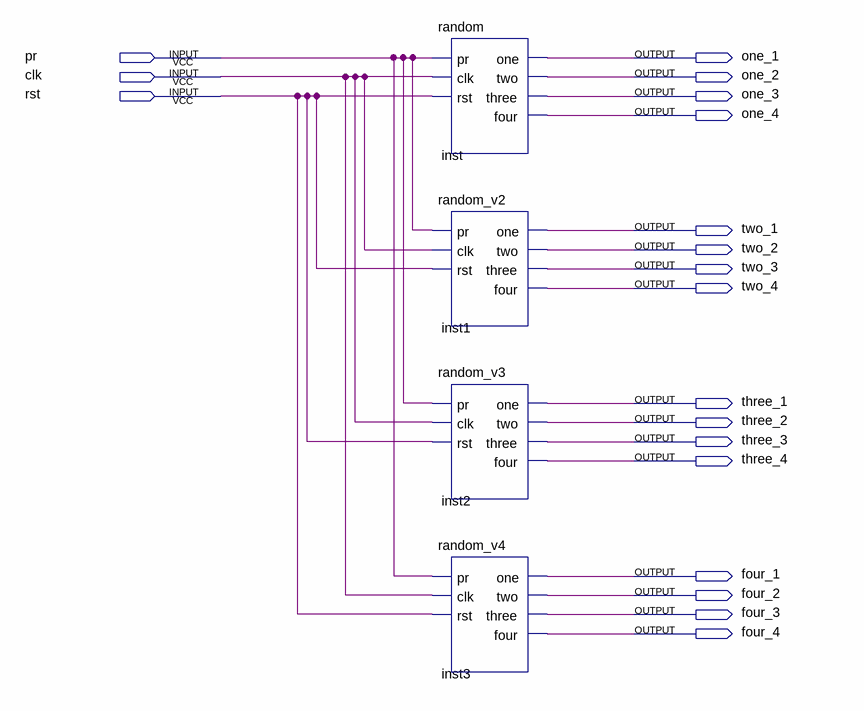
[diagram p0: schematic sheet]
// Quartus schematic test.bdf as structural Verilog: 4 symbols, 19 pins
module test (
  input  pr,
  input  clk,
  input  rst,
  output one_1,
  output one_2,
  output one_3,
  output one_4,
  output two_1,
  output two_2,
  output two_3,
  output two_4,
  output three_1,
  output three_2,
  output three_3,
  output three_4,
  output four_1,
  output four_2,
  output four_3,
  output four_4
);

  random inst (.pr(pr), .clk(clk), .rst(rst), .one(one_1), .two(one_2), .three(one_3), .four(one_4));
  random_v2 inst1 (.pr(pr), .clk(clk), .rst(rst), .one(two_1), .two(two_2), .three(two_3), .four(two_4));
  random_v3 inst2 (.pr(pr), .clk(clk), .rst(rst), .one(three_1), .two(three_2), .three(three_3), .four(three_4));
  random_v4 inst3 (.pr(pr), .clk(clk), .rst(rst), .one(four_1), .two(four_2), .three(four_3), .four(four_4));
endmodule
